# EAGLE design WASP-PCB-WDT-F1R0 (EAGLE 6.4)
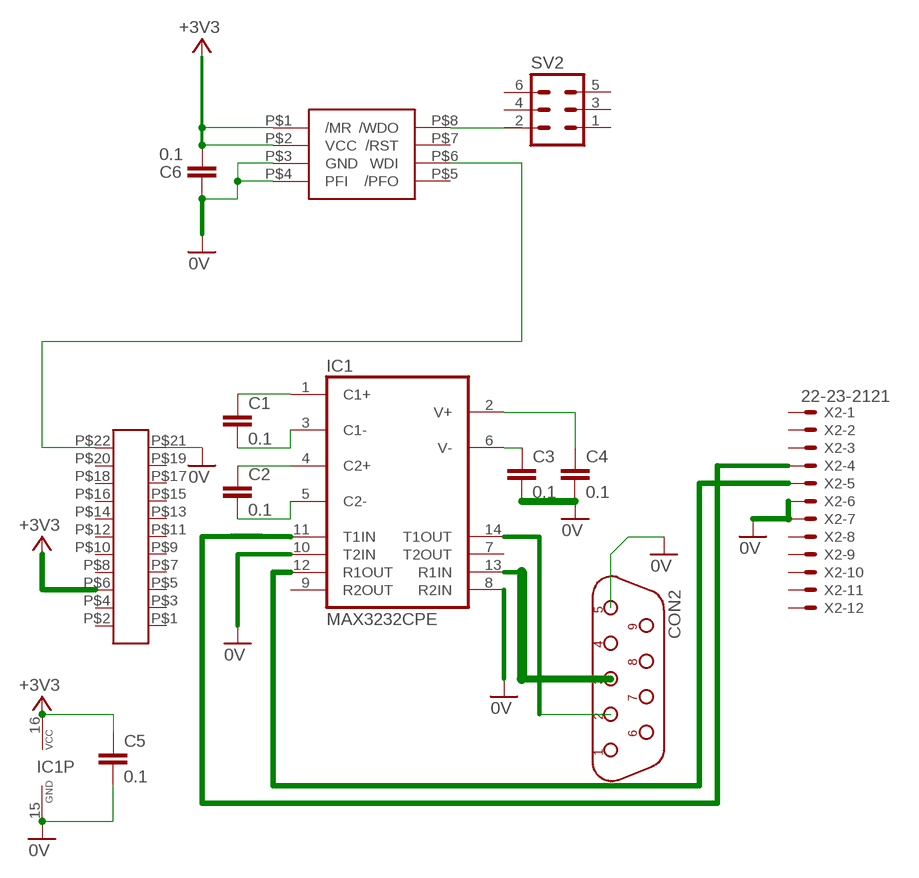
[diagram p0: schematic, sheet 1]

## Parts
C1  0.1  C5/2.5  [C5B2.5]
C2  0.1  C5/2.5  [C5B2.5]
C3  0.1  C5/2.5  [C5B2.5]
C4  0.1  C5/2.5  [C5B2.5]
C5  0.1  C5/2.5  [C5B2.5]
C6  0.1  C5/2.5  [C5B2.5]
CON2  CONNECT_DB9F/90  [CONNECT_D-09F/90]
IC1  MAX3232CPE  [DIL16]
SV2  CON-ML_ML6  [CON-ML_ML6]
U$2  ML22PML22P-PKG  [CON-ML-22P]
U$3  ADM706P  [ADM706P]
X2  22-23-2121  [22-23-2121]

## Nets
0V [0V]: C3.2 C4.2 C5.2 C6.2 CON2.5 IC1.8(R2IN) IC1.10(T2IN) IC1.15(GND) U$2.P$21 U$3.P$3(GND) U$3.P$4(PFI) X2.6 X2.7
+3V3 [+Vcc]: C5.1 C6.1 IC1.16(VCC) U$2.P$6 U$3.P$1(/MR) U$3.P$2(VCC)
N$1 [0V]: U$2.P$22 U$3.P$6(WDI)
N$2 [B_Signal]: C1.1 IC1.1(C1+)
N$3: C1.2 IC1.3(C1-)
N$4 [B_Signal]: C2.1 IC1.4(C2+)
N$5 [B_Signal]: C2.2 IC1.5(C2-)
N$6: C4.1 IC1.2(V+)
N$7 [B_Signal]: C3.1 IC1.6(V-)
N$8 [B_Signal]: IC1.12(R1OUT) X2.5
N$9: SV2.2 U$3.P$8(/WDO)
N$11 [B_Signal]: CON2.3 IC1.13(R1IN)
T1IN: IC1.11(T1IN) X2.4
T1OUT: CON2.2 IC1.14(T1OUT)
Unconnected: CON2.1 CON2.4 CON2.6 CON2.7 CON2.8 CON2.9 IC1.7(T2OUT) IC1.9(R2OUT) SV2.1 SV2.3 SV2.4 SV2.5 SV2.6 U$2.P$1 U$2.P$2 U$2.P$3 U$2.P$4 U$2.P$5 U$2.P$7 U$2.P$8 U$2.P$9 U$2.P$10 U$2.P$11 U$2.P$12 U$2.P$13 U$2.P$15 U$2.P$16 U$2.P$17 U$2.P$18 U$2.P$19 U$2.P$20 U$3.P$5(/PFO) U$3.P$7(/RST) X2.1 X2.2 X2.3 X2.8 X2.9 X2.10 X2.11 X2.12

## Power pins joined to a net without a drawn wire
14: U$2.P$14

## Library data of the parts
C1-C6 = capacitor-wima:C: CAPACITOR naming: grid - package width
CON2 = Wasp-Interface:CONNECT_DB9F/90
IC1 = maxim:MAX3232*: True RS-232 Transceivers 3.0V to 5.5V, Low-Power up to 1Mbps, Using Four 0.1µF External Capacitors Source: http://pdfserv.maxim-ic.com/en/ds/MAX3222-MAX3241.pdf; MF: MAXIM; MPN: MAX3232CPE+; OC_FARNELL: 9724494; OC_NEWARK: 68K4626
SV2 = Wasp-PCB-wdt-r7v1:CON-ML_ML6: HARTING; OC_FARNELL: unknown; OC_NEWARK: unknown
U$2 = Helheim-Glacier:ML22P
U$3 = Helheim-Glacier:ADM706P
X2 = con-molex:22-23-2121: .100" (2.54mm) Center Header - 12 Pin; MF: MOLEX; MPN: 22-23-2121; OC_FARNELL: 1462935; OC_NEWARK: 56H0456

## Net classes
0 default: width 1 mm, drill 0.8 mm, clearance 0.8 mm
1 0V: width 2 mm, drill 0.8 mm, clearance 0.8 mm
2 +Vcc: width 2 mm, drill 0.8 mm, clearance 0.8 mm
3 B_Signal: width 1 mm, drill 0.8 mm, clearance 0.8 mm
4 T_Signal: width 1 mm, drill 0.8 mm, clearance 0.8 mm

## Board
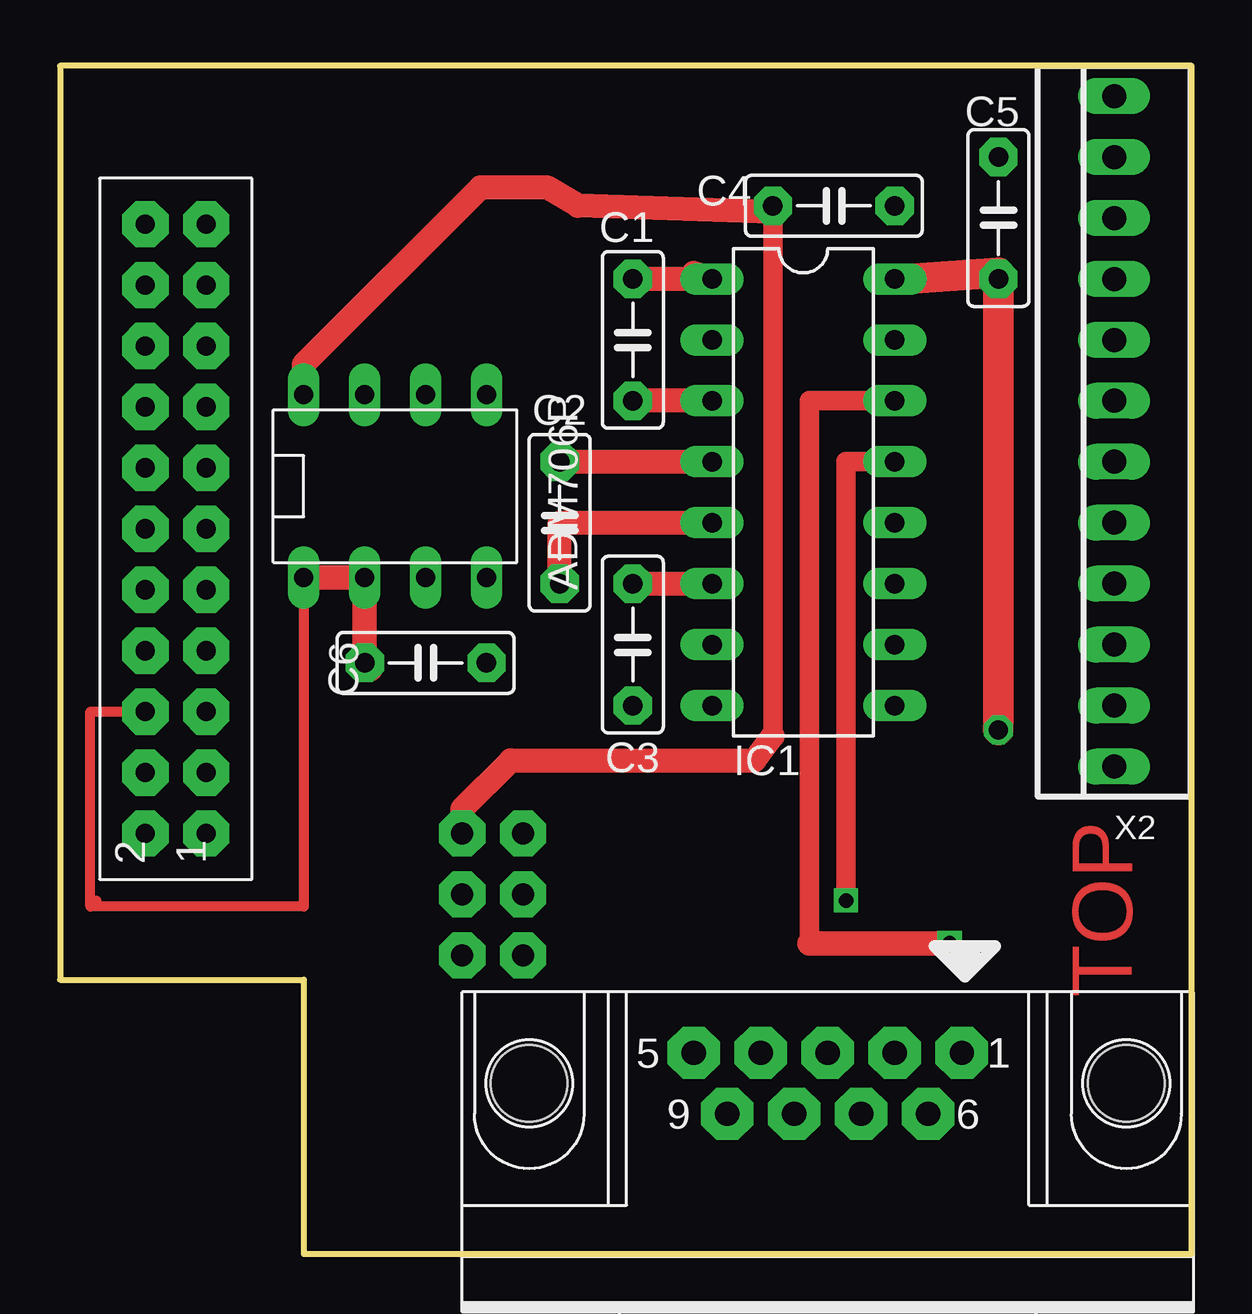
[diagram p1: board, top side]
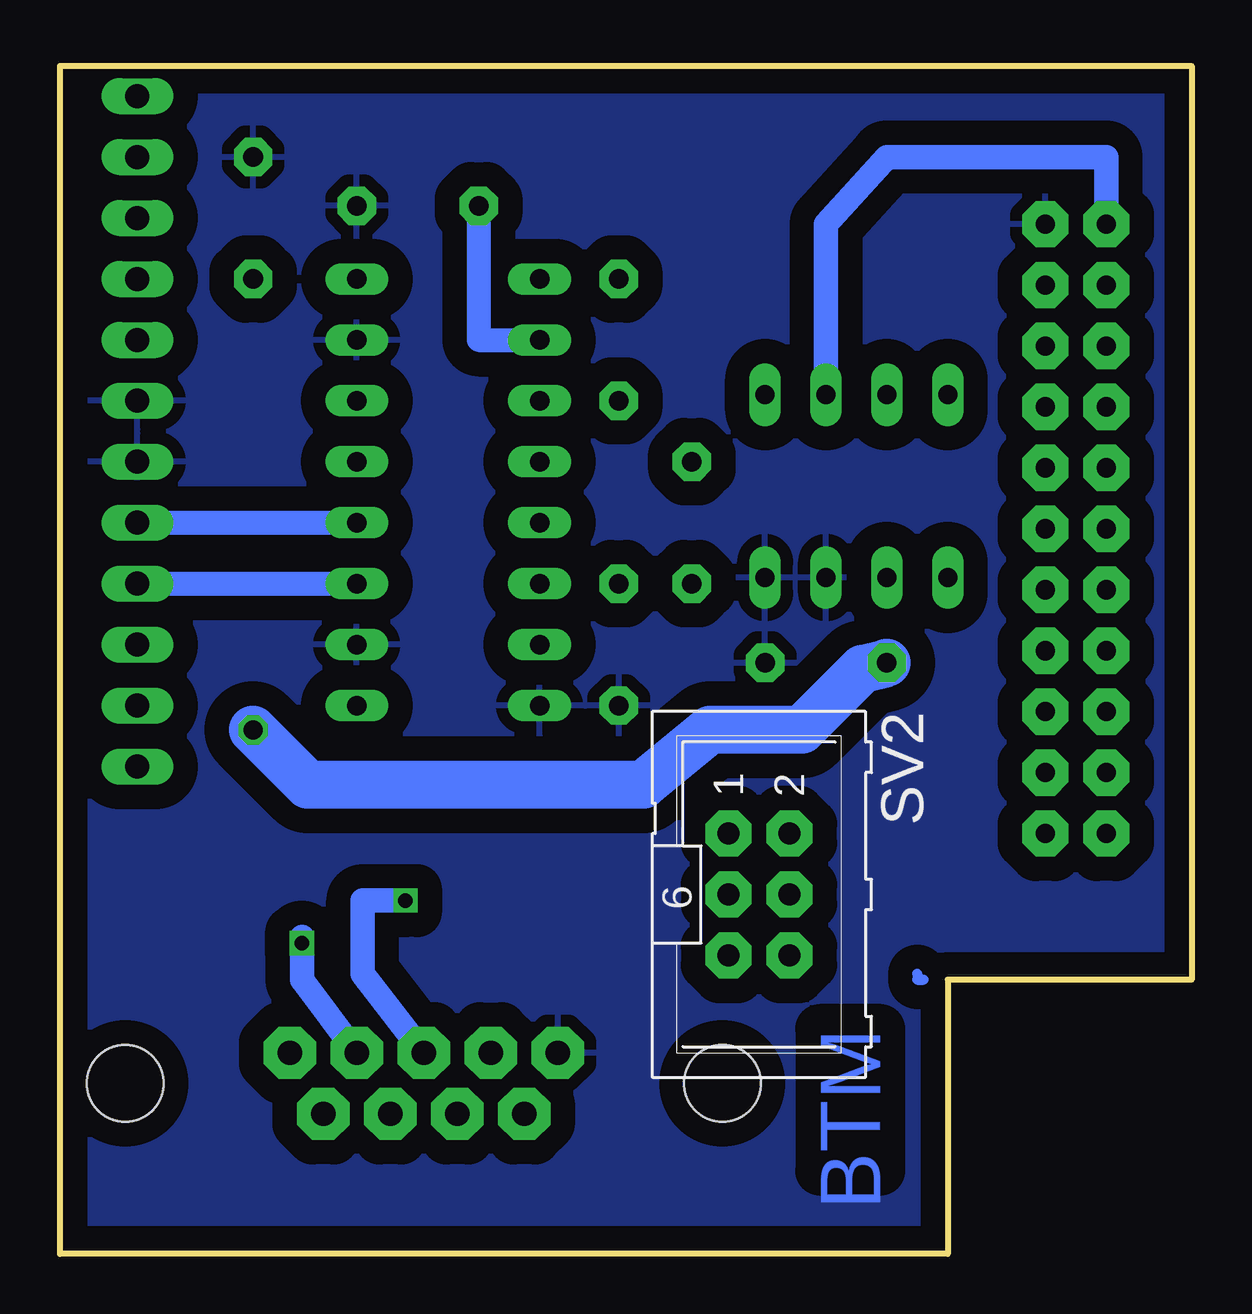
[diagram p2: board, bottom side, seen from below]

Size 47.17 x 49.52 mm. Coordinates in mm from the lower left corner, seen from the top.
Outline: 0,11.43 10.16,11.43 10.16,0 47.17,0 47.17,49.52 0,49.52 0,11.43
Copper layers (1*16): Top 0.35mm / dielectric 1mm / Bottom 0.035mm
Design rules "default *": minimum track width 10mil, minimum drill 24mil, track to track 30mil, track to pad 30mil, pad to pad 30mil, via to via 30mil, smd to smd 8mil, copper to edge 40mil, drill to drill 10mil, minimum pad ring 10mil, minimum via ring 8mil, stop-mask expansion 4mil, vias tented up to drill 0mil, thermal gap 20mil

### Footprints (pad centres in the part's own frame; a part is rotated, then mirrored left to right if it is on the bottom)
C5B2.5 = drill 0.813 pad 1.6 octagon: 1 -2.54,0; 2 2.54,0
CONNECT_D-09F/90 = drill 1.016 pad 2.184 octagon: 1 -5.588,-1.27; 2 -2.794,-1.27; 3 0,-1.27; 4 2.794,-1.27; 5 5.588,-1.27; 6 -4.191,1.27; 7 -1.397,1.27; 8 1.397,1.27; 9 4.191,1.27 | hole 3.2: 12.446,0; -12.446,0
DIL16 = drill 0.813 long: 1 -8.89,-3.81; 2 -6.35,-3.81; 3 -3.81,-3.81; 4 -1.27,-3.81; 5 1.27,-3.81; 6 3.81,-3.81; 7 6.35,-3.81; 8 8.89,-3.81; 9 8.89,3.81; 10 6.35,3.81; 11 3.81,3.81; 12 1.27,3.81; 13 -1.27,3.81; 14 -3.81,3.81; 15 -6.35,3.81; 16 -8.89,3.81
CON-ML_ML6 = drill 0.914 pad 1.93 octagon: 1 -2.54,-1.27; 2 -2.54,1.27; 3 0,-1.27; 4 0,1.27; 5 2.54,-1.27; 6 2.54,1.27
CON-ML-22P = drill 0.8 pad 1.93 octagon: P$1 1.27,-12.7; P$2 -1.27,-12.7; P$3 1.27,-10.16; P$4 -1.27,-10.16; P$5 1.27,-7.62; P$6 -1.27,-7.62; P$7 1.27,-5.08; P$8 -1.27,-5.08; P$9 1.27,-2.54; P$10 -1.27,-2.54; P$11 1.27,0; P$12 -1.27,0; P$13 1.27,2.54; P$14 -1.27,2.54; P$15 1.27,5.08; P$16 -1.27,5.08; P$17 1.27,7.62; P$18 -1.27,7.62; P$19 1.27,10.16; P$20 -1.27,10.16; P$21 1.27,12.7; P$22 -1.27,12.7
ADM706P = drill 0.8 long: P$1 -3.81,3.81; P$2 -3.81,1.27; P$3 -3.81,-1.27; P$4 -3.81,-3.81; P$5 3.81,-3.81; P$6 3.81,-1.27; P$7 3.81,1.27; P$8 3.81,3.81
22-23-2121 = drill 1 long: 1 -13.97,0; 2 -11.43,0; 3 -8.89,0; 4 -6.35,0; 5 -3.81,0; 6 -1.27,0; 7 1.27,0; 8 3.81,0; 9 6.35,0; 10 8.89,0; 11 11.43,0; 12 13.97,0

### Placement (x,y rotation side)
C1  23.88,38.1 270 top
C2  20.83,30.48 270 top
C3  23.88,25.4 270 top
C4  32.26,43.69 0 top
C5  39.12,43.18 90 top
C6  15.24,24.64 0 top
CON2  32,7.11 180 top
IC1  30.99,31.75 270 top
SV2  18.03,14.99 270 bottom
U$2  4.83,30.23 0 top
U$3  13.97,32 90 top
X2  43.94,34.29 90 top

### Tracks (layer width: path | path; a pad name or v marks a point on that pad's centre or on a via)
0V
  pour Bottom (isolate 1.016): 0,11.43 0,49.53 47.24,49.53 47.24,0 10.16,0 10.16,11.43
+3V3  (via drill 0.8)
  Top 0.406: U$3.P$1 10.16,14.48 1.27,14.48 | 1.27,14.48 1.52,14.73 | 1.27,14.48 1.27,22.61 U$2.P$6
  Top 1.016: U$3.P$1 U$3.P$2 C6.1 12.95,24.38
  Top 1.27: IC1.16 35.31,40.64 39.12,40.89 C5.1 v39.12,21.84
  Bottom 2: v39.12,21.84 36.83,19.56 22.86,19.56 20.07,21.84 16.26,21.84 13.72,24.38 C6.1
N$1
  Bottom 1.016: U$2.P$22 3.56,45.72 12.7,45.72 15.24,42.93 U$3.P$6
N$2
  Top 1: 26.42,40.89 IC1.1 C1.1
N$3
  Top 1: IC1.3 C1.2
N$4
  Top 1: C2.1 IC1.4
N$5
  Top 1: IC1.5 20.83,30.48 C2.2
N$6
  Bottom 1: IC1.2 29.72,38.1 C4.1
N$7
  Top 1: C3.1 IC1.6
N$8
  Bottom 1: X2.5 IC1.12
N$9
  Top 0.813: 29.72,21.59 29.72,43.43
  Top 1: U$3.P$8 10.16,37.08 17.53,44.45 20.32,44.45 21.59,43.69 29.72,43.43 | 29.72,21.59 28.96,20.57 18.8,20.57 16.76,18.54 SV2.2
N$10
  Bottom 0.406: 11.43,11.68 11.43,11.43 11.18,11.43
N$11  (via drill 0.6)
  Top 0.813: v32.77,14.73 32.77,33.02 IC1.13
  Bottom 1.016: v32.77,14.73 34.54,14.73 34.54,11.68 CON2.3
T1IN
  Bottom 1: X2.4 IC1.11
T1OUT  (via drill 0.6)
  Top 0.813: 31.24,12.95 31.24,35.56 IC1.14
  Top 1.016: v37.08,12.95 31.24,12.95
  Bottom 1.016: CON2.2 37.08,11.43 v37.08,12.95 37.08,13.21
(copper drawn outside any net)
  shapes: Top area x1

### Text on the board
Top: TOP
Bottom: BTM